# Altium schematic sheet USB_HS2.SchDoc
size A4
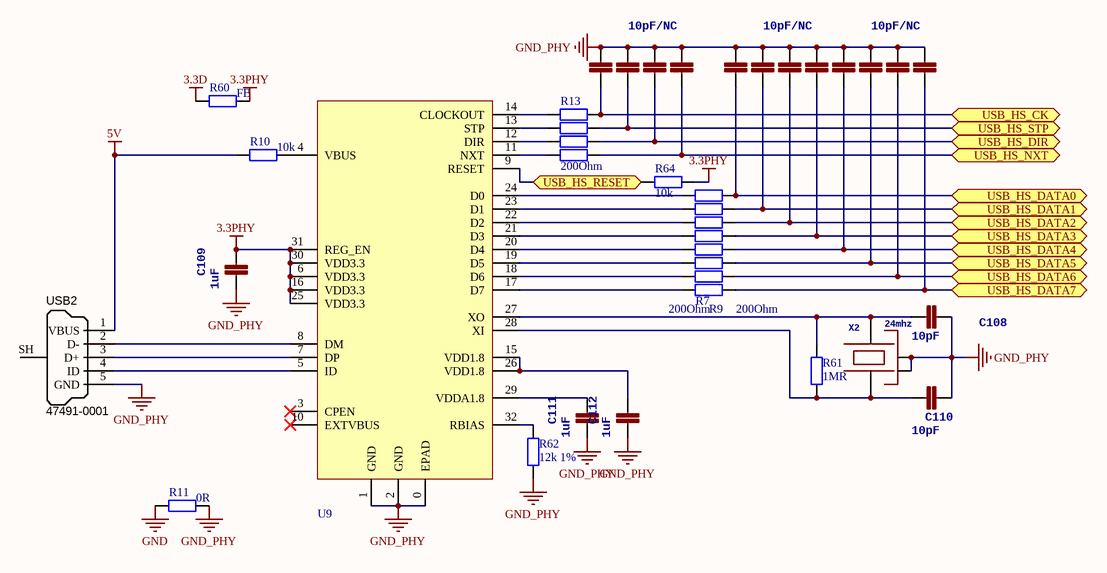
[diagram p0: USB_HS2.SchDoc]

## Parts
C17  10pF/NC  [0402]
C18  1n  [0402]  (value not drawn)
C19  1n  [0402]  (value not drawn)
C20  1n  [0402]  (value not drawn)
C21  10pF/NC  [0402]
C22  1n  [0402]  (value not drawn)
C23  1n  [0402]  (value not drawn)
C24  1n  [0402]  (value not drawn)
C25  10pF/NC  [0402]
C26  1n  [0402]  (value not drawn)
C27  1n  [0402]  (value not drawn)
C28  1n  [0402]  (value not drawn)
C108  10pF  [0402]
C109  1uF  [0402]
C110  10pF  [0402]
C111  1uF  [0402]
C112  1uF  [0402]
R7  value 200Ohm  [0402X4]  (hidden comment: Res*4)
R9  value 200Ohm  [0402X4]  (hidden comment: Res*4)
R10  10k  [0402]
R11  0R  [0603]
R13  value 200Ohm  [0402X4]  (hidden comment: Res*4)
R60  FB  [0603]
R61  1MR  [0402]
R62  12k 1%  [0402]
R64  10k  [0402]
U9  USB3300_1  [USB3300]  (value not drawn)
USB2  Manufacturer Part Number 1: 47491-0001  [MICRO-YZX]  (hidden comment: USB Micro Type B)
X2  24mhz  [OSCILLATOR-3.2X2.5]

## Ports
USB_HS_CK, USB_HS_DATA0, USB_HS_DATA1, USB_HS_DATA2, USB_HS_DATA3, USB_HS_DATA4, USB_HS_DATA5, USB_HS_DATA6, USB_HS_DATA7, USB_HS_DIR, USB_HS_NXT, USB_HS_RESET, USB_HS_STP

## Nets
3.3D: R60.1
3.3PHY: C109.1 R60.2 R64.1 U9.6(VDD3.3) U9.16(VDD3.3) U9.25(VDD3.3) U9.30(VDD3.3) U9.31(REG_EN)
5V: R10.1 USB2.1(VBUS)
GND: R11.1
GND_PHY: C17.2 C18.2 C19.2 C20.2 C21.2 C22.2 C23.2 C24.2 C25.2 C26.2 C27.2 C28.2 C108.1 C109.2 C110.1 C111.2 C112.2 R11.2 R62.1 U9.0(EPAD) U9.1(GND) U9.2(GND) USB2.5(GND) X2.2(NC_2) X2.4(NC_4)
USB_HS_CK: C17.1 R13.4 ; port USB_HS_CK
USB_HS_DATA0: C21.1 R9.8 ; port USB_HS_DATA0
USB_HS_DATA1: C22.1 R9.7 ; port USB_HS_DATA1
USB_HS_DATA2: C23.1 R9.6 ; port USB_HS_DATA2
USB_HS_DATA3: C24.1 R9.5 ; port USB_HS_DATA3
USB_HS_DATA4: C25.1 R7.8 ; port USB_HS_DATA4
USB_HS_DATA5: C26.1 R7.7 ; port USB_HS_DATA5
USB_HS_DATA6: C27.1 R7.6 ; port USB_HS_DATA6
USB_HS_DATA7: C28.1 R7.5 ; port USB_HS_DATA7
USB_HS_DIR: C19.1 R13.2 ; port USB_HS_DIR
USB_HS_NXT: C20.1 R13.1 ; port USB_HS_NXT
USB_HS_RESET: R64.2 U9.9(RESET) ; port USB_HS_RESET
USB_HS_STP: C18.1 R13.3 ; port USB_HS_STP
NetC108_2: C108.2 R61.2 U9.27(XO) X2.3
NetC110_2: C110.2 R61.1 U9.28(XI) X2.1
NetC111_1: C111.1 U9.29(VDDA1.8)
NetC112_1: C112.1 U9.15(VDD1.8) U9.26(VDD1.8)
NetR7_1: R7.1 U9.20(D4)
NetR7_2: R7.2 U9.19(D5)
NetR7_3: R7.3 U9.18(D6)
NetR7_4: R7.4 U9.17(D7)
NetR9_1: R9.1 U9.24(D0)
NetR9_2: R9.2 U9.23(D1)
NetR9_3: R9.3 U9.22(D2)
NetR9_4: R9.4 U9.21(D3)
NetR10_2: R10.2 U9.4(VBUS)
NetR13_5: R13.5 U9.14(CLOCKOUT)
NetR13_6: R13.6 U9.13(STP)
NetR13_7: R13.7 U9.12(DIR)
NetR13_8: R13.8 U9.11(NXT)
NetR62_2: R62.2 U9.32(RBIAS)
NetU9_5: U9.5(ID) USB2.4(ID)
NetU9_7: U9.7(DP) USB2.3(D+)
NetU9_8: U9.8(DM) USB2.2(D-)

Not connected (* = marked no-connect by the designer): U9 3(CPEN)* 10(EXTVBUS)*; USB2 SH(Shell)

## Library data of the parts
C17-C28 C108-C112 = CAP0402-CAP: <b>Capacitor</b> / Standard 0603 ceramic capacitor, and 0.1" leaded capacitor.; PARTNO: CC0402ZRY5V7BB104
R7 R9 R13 = Res*4: Resistor; Published: 8-Jun-2000; LatestRevisionDate: 17-Jul-2002; LatestRevisionNote: Re-released for DXP Platform.; PackageReference: AXIAL-0.4; Publisher: Altium Limited; PackageDescription: Axial Device, Thru-Hole; 2 Leads; 0.4 in Pin Spacing
R10 R11 R60-R62 R64 = Res2: Resistor; Value: 0Ohm; Published: 8-Jun-2000; LatestRevisionDate: 17-Jul-2002; LatestRevisionNote: Re-released for DXP Platform.; PackageReference: AXIAL-0.4; Publisher: Altium Limited; PackageDescription: Axial Device, Thru-Hole; 2 Leads; 0.4 in Pin Spacing
USB2 = USB_Micro_TypeB: Connector SMD USB Micro Type B middle mount; Manufacturer 1: Molex Inc; SCDType: undef; Package / Case: SMD; Supplier 1: Digi-Key; Supplier Part Number 1: WM17142CT-ND
X2 = OSCILLATOR-3.2X2.5: Crystal Oscillator in 3.2x2.5 SMD